# Altium schematic sheet usb_interface.SchDoc (part 1 of 3)
size A4; SheetNumber: 5; SheetTotal: 5
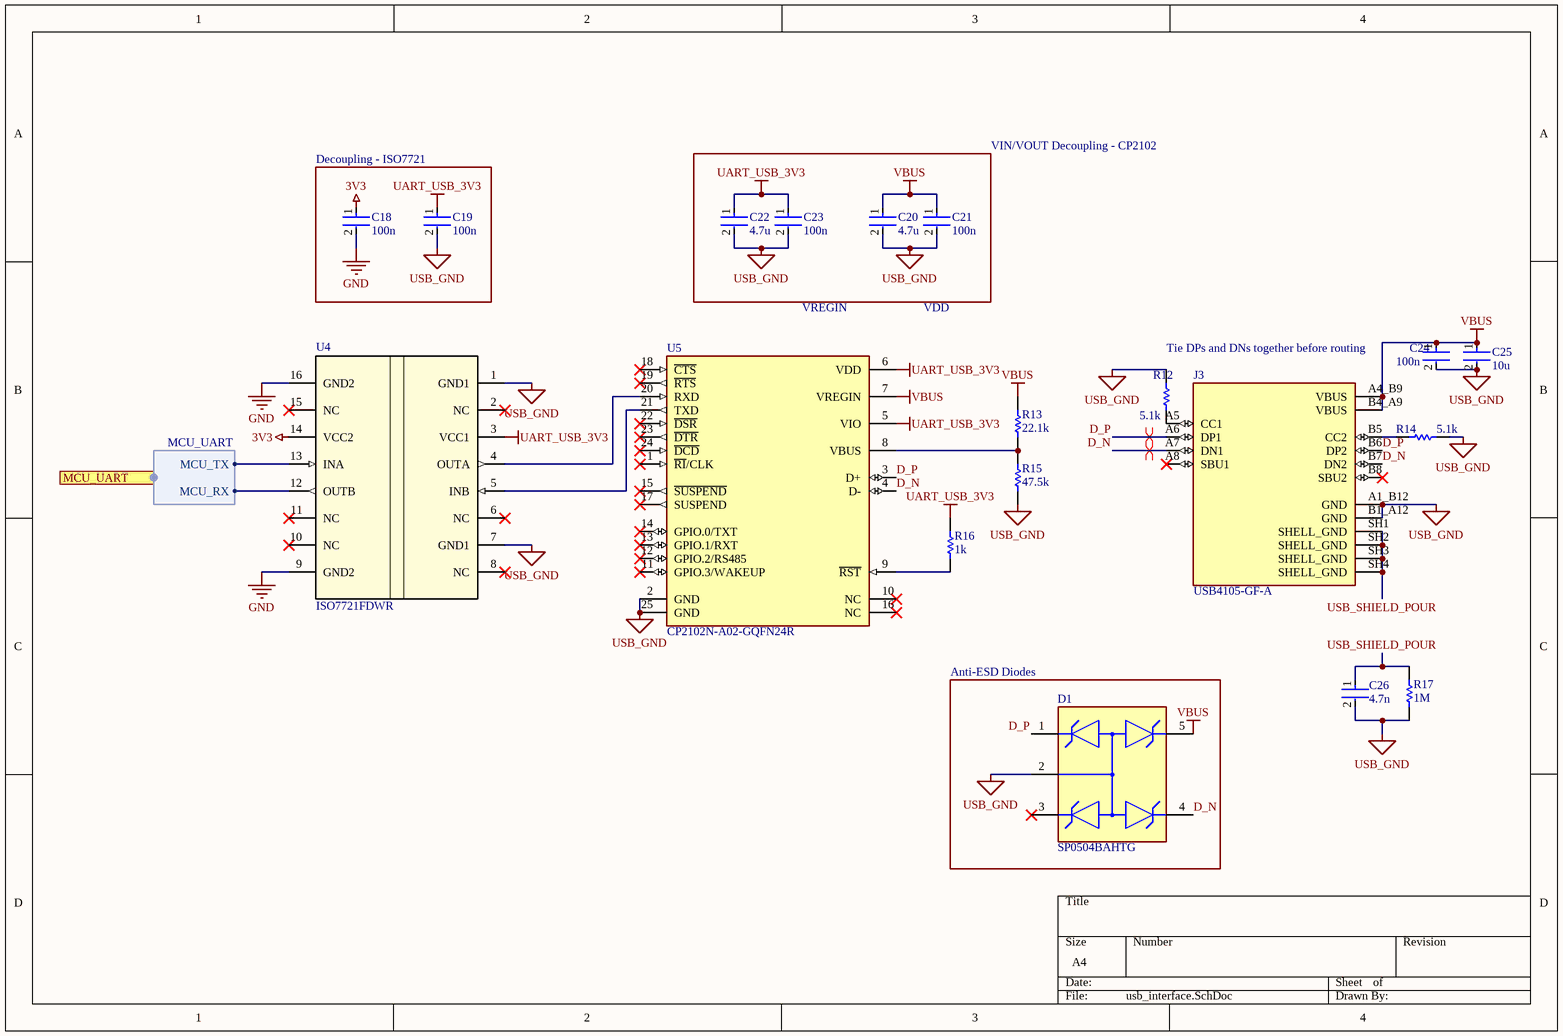
[diagram p0: usb_interface.SchDoc]

## Parts
C18  100n  [C_IM 0603]
C19  100n  [C_IM 0603]
C20  4.7u  [C_IM 0805]
C21  100n  [C_IM 0603]
C22  4.7u  [C_IM 0805]
C23  100n  [C_IM 0603]
C24  100n  [C_IM 0603]
C25  10u  [C_IM 0603]
C26  4.7n  [C_IM 0805]
D1  SP0504BAHTG  [SOT-23-5 Small]
J3  USB4105-GF-A  [GCT_USB4105-GF-A]
R12  5.1k  [R_IM 0805]
R13  22.1k  [R_IM 0805]
R14  5.1k  [R_IM 0805]
R15  47.5k  [R_IM 0805]
R16  1k  [R_IM 0805]
R17  1M  [R_IM 0805]
U4  ISO7721FDWR  [16-SOIC]
U5  CP2102N-A02-GQFN24R  [24-VFQFN]

## Blocks framed on the sheet
Decoupling - ISO7721: C18 C19
VIN/VOUT Decoupling - CP2102: C20-C23
Anti-ESD Diodes: D1

## Ports
MCU_UART (harness MCU_UART, see high_voltage_controller[3C], mcu[2C])

## Harnesses
MCU_UART: MCU_RX, MCU_TX

## Nets
3V3: C18.1 U4.14(VCC2)
GND: C18.2 U4.9(GND2) U4.16(GND2)
UART_USB_3V3: C19.1 C22.1 C23.1 R16.2 U4.3(VCC1) U5.5(VIO) U5.6(VDD)
USB_GND: C19.2 C20.2 C21.2 C22.2 C23.2 C24.2 C25.2 C26.2 D1.2 J3.A1_B12(GND) J3.B1_A12(GND) R12.1 R14.2 R15.1 R17.1 U4.1(GND1) U4.7(GND1) U5.2(GND) U5.25(GND)
VBUS: C20.1 C21.1 C24.1 C25.1 D1.5 J3.A4_B9(VBUS) J3.B4_A9(VBUS) R13.2 U5.7(VREGIN)
D_N: D1.4 J3.A7(DN1) J3.B7(DN2) U5.4(D-)
D_P: D1.1 J3.A6(DP1) J3.B6(DP2) U5.3(D+)
USB_SHIELD_POUR: C26.1 J3.SH1(SHELL_GND) J3.SH2(SHELL_GND) J3.SH3(SHELL_GND) J3.SH4(SHELL_GND) R17.2
NetJ3_A5: J3.A5(CC1) R12.2
NetJ3_B5: J3.B5(CC2) R14.1
NetR13_1: R13.1 R15.2 U5.8(VBUS)
NetR16_1: R16.1 U5.9(~{RST})
NetU4_4: U4.4(OUTA) U5.20(RXD)
NetU4_5: U4.5(INB) U5.21(TXD)
NetU4_12: U4.12(OUTB) ; port MCU_UART.MCU_RX
NetU4_13: U4.13(INA) ; port MCU_UART.MCU_TX

Not connected (* = marked no-connect by the designer): D1 3*; J3 A8(SBU1)* B8(SBU2)*; U4 2(NC)* 6(NC)* 8(NC)* 10(NC)* 11(NC)* 15(NC)*; U5 1(~{RI}/CLK)* 10(NC)* 11(GPIO.3/WAKEUP)* 12(GPIO.2/RS485)* 13(GPIO.1/RXT)* 14(GPIO.0/TXT)* 15(~{SUSPEND})* 16(NC)* 17(SUSPEND)* 18(~{CTS})* 19(~{RTS})* 22(~{DSR})* 23(~{DTR})* 24(~{DCD})*

## Layout directives
differential pair: D_N, D_P

## Notes on the sheet
- VREGIN
- VDD
- Tie DPs and DNs together before routing